# Altium schematic sheet MCU.SchDoc
size A4; SheetNumber: 2; SheetTotal: 2
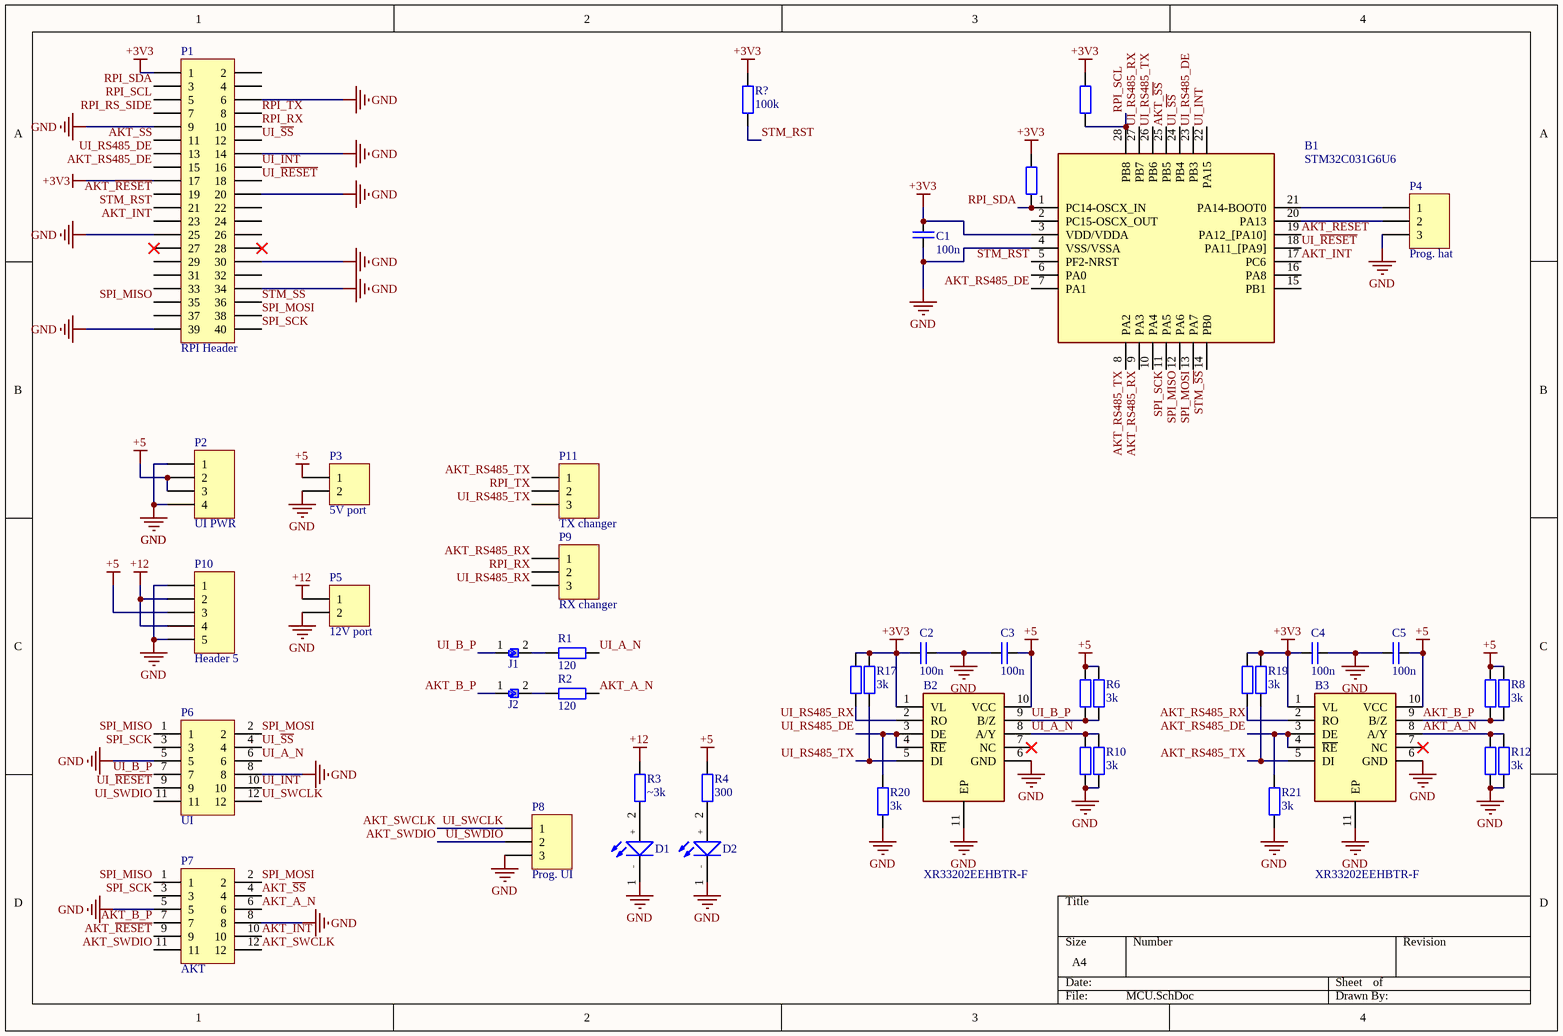
[diagram p0: MCU.SchDoc]

## Parts
B1  STM32C031G6U6  [QFN50P400X400X60-28N-D]
B2  XR33202EEHBTR-F  [SON50P300X300X80-11N-D]
B3  XR33202EEHBTR-F  [SON50P300X300X80-11N-D]
C1  100n  [R1005_0402i_L]
C2  100n  [R1005_0402i_L]
C3  100n  [R1005_0402i_L]
C4  100n  [R1005_0402i_L]
C5  100n  [R1005_0402i_L]
D1  LED  [LED1608_0603I_L]  (value not drawn)
D2  LED  [LED1608_0603I_L]  (value not drawn)
J1  solder_jumper  [solder_jumper_triangle]  (value not drawn)
J2  solder_jumper  [solder_jumper_triangle]  (value not drawn)
P1  RPI Header  [HDR2X20]
P2  UI PWR  [HDR1X4]
P3  5V port  [HDR1X2]
P4  Prog. hat  [HDR1X3]
P5  12V port  [HDR1X2]
P6  UI  [1.27mm headet tht]
P7  AKT  [1.27mm headet tht]
P8  Prog. UI  [HDR1X3]
P9  RX changer  [HDR1X3]
P10  Header 5  [HDR1X5]
P11  TX changer  [HDR1X3]
R1  120  [R1005_0402i_L]
R2  120  [R1005_0402i_L]
R3  ~3k  [R1005_0402i_L]
R4  300  [R1005_0402i_L]
R5  3k  [R1005_0402i_L]  (value not drawn)
R6  3k  [R1005_0402i_L]
R7  3k  [R1005_0402i_L]  (value not drawn)
R8  3k  [R1005_0402i_L]
R9  3k  [R1005_0402i_L]  (value not drawn)
R10  3k  [R1005_0402i_L]
R11  3k  [R1005_0402i_L]  (value not drawn)
R12  3k  [R1005_0402i_L]
R14  3k  [R1005_0402i_L]  (value not drawn)
R15  3k  [R1005_0402i_L]  (value not drawn)
R16  3k  [R1005_0402i_L]  (value not drawn)
R17  3k  [R1005_0402i_L]
R18  3k  [R1005_0402i_L]  (value not drawn)
R19  3k  [R1005_0402i_L]
R20  3k  [R1005_0402i_L]
R21  3k  [R1005_0402i_L]
R?  100k  [R1005_0402i_L]

## Nets
+3V3: B1.3(VDD/VDDA) B2.1(VL) B3.1(VL) C1.2 C2.1 C4.1 P1.1 P1.17 R14.2 R15.2 R16.2 R17.2 R18.2 R19.2 R?.2
+5: B2.10(VCC) B3.10(VCC) C3.2 C5.2 P2.2 P2.3 P3.1 P10.3 R4.1 R5.2 R6.2 R7.2 R8.2
+12: P5.1 P10.2 P10.4 R3.1
GND: B1.4(VSS/VSSA) B2.6(GND) B2.11(EP) B3.6(GND) B3.11(EP) C1.1 C2.2 C3.1 C4.2 C5.1 D1.1(-) D2.1(-) P1.6 P1.9 P1.14 P1.20 P1.25 P1.30 P1.34 P1.39 P2.1 P2.4 P3.2 P4.3 P5.2 P6.5 P6.8 P7.5 P7.8 P8.3 P10.1 P10.5 R9.1 R10.1 R11.1 R12.1 R20.1 R21.1
AKT_A_N: B3.8(A/Y) P7.6 R2.2 R11.2 R12.2
AKT_B_P: B3.9(B/Z) J2.1 P7.7 R7.1 R8.1
AKT_INT: B1.17(PC6) P1.23 P7.10
AKT_~{RESET}: B1.19(PA12_[PA10]) P1.19 P7.9
AKT_RS485_DE: B1.7(PA1) B3.3(DE) B3.4(~{RE}) P1.15 R21.2
AKT_RS485_RX: B1.9(PA3) B3.2(RO) P9.1 R18.1
AKT_RS485_TX: B1.8(PA2) B3.5(DI) P11.1 R19.1
AKT_~{SS}: B1.25(PB5) P1.11 P7.4
AKT_SWCLK: P6.12 P7.12 P8.1  [also labelled UI_SWCLK]
AKT_SWDIO: P6.11 P7.11 P8.2  [also labelled UI_SWDIO]
RPI_RS_SIDE: P1.7
RPI_RX: P1.10 P9.2
RPI_SCL: B1.28(PB8) P1.5 R14.1
RPI_SDA: B1.1(PC14-OSCX_IN) P1.3 R15.1
RPI_TX: P1.8 P11.2
SPI_MISO: B1.12(PA6) P1.35 P6.1 P7.1
SPI_MOSI: B1.13(PA7) P1.38 P6.2 P7.2
SPI_SCK: B1.11(PA5) P1.40 P6.3 P7.3
STM_RST: B1.5(PF2-NRST) P1.21 R?.1
STM_~{SS}: B1.14(PB0) P1.36
UI_A_N: B2.8(A/Y) P6.6 R1.2 R9.2 R10.2
UI_B_P: B2.9(B/Z) J1.1 P6.7 R5.1 R6.1
UI_INT: B1.22(PA15) P1.16 P6.10
UI_~{RESET}: B1.18(PA11_[PA9]) P1.18 P6.9
UI_RS485_DE: B1.23(PB3) B2.3(DE) B2.4(~{RE}) P1.13 R20.2
UI_RS485_RX: B1.27(PB7) B2.2(RO) P9.3 R16.1
UI_RS485_TX: B1.26(PB6) B2.5(DI) P11.3 R17.1
UI_~{SS}: B1.24(PB4) P1.12 P6.4
NetB1_20: B1.20(PA13) P4.2
NetB1_21: B1.21(PA14-BOOT0) P4.1
NetD1_2: D1.2(+) R3.2
NetD2_2: D2.2(+) R4.2
NetJ1_2: J1.2 R1.1
NetJ2_2: J2.2 R2.1

Not connected (* = marked no-connect by the designer): B1 2(PC15-OSCX_OUT) 6(PA0) 10(PA4) 15(PB1) 16(PA8); B2 7(NC)*; B3 7(NC)*; P1 2 4 22 24 26 27* 28* 29 31 32 33 37

## Library data of the parts
B1 = STM32C031G6U6: Mainstream Arm Cortex-M0+ MCU with 32 Kbytes of Flash memory, 12 Kbytes RAM, 48 MHz CPU, 2x USART, timers, ADC, comm. I/F, 2-3.6V; Manufacturer_Name: STMicroelectronics; Geometry.Height: 0.6mm; Mouser Part Number: 511-STM32C031G6U6; Mouser Price/Stock: https://www.mouser.co.uk/ProductDetail/STMicroelectronics/STM32C031G6U6?qs=IPgv5n7u5QZqRf3nOTChhw%3D%3D; Manufacturer_Part_Number: STM32C031G6U6; Datasheet Link: https://www.st.com/resource/en/datasheet/stm32c031c4.pdf
B2 B3 = XR33202EEHBTR-F: RS-422/RS-485 Interface IC Wide Supply Trans with I/O Interface; Manufacturer_Name: MaxLinear, Inc.; Geometry.Height: 0.8mm; Mouser Part Number: 701-XR33202EEHBTR-F; Mouser Price/Stock: https://www.mouser.co.uk/ProductDetail/MaxLinear/XR33202EEHBTR-F?qs=GtWAI9k6EVi4nRW8bj1LFw%3D%3D; Manufacturer_Part_Number: XR33202EEHBTR-F; Datasheet Link: https://www.maxlinear.com/ds/xr33202.pdf
C1-C5 = C: Capacitor
P1 = Header 20X2: Header, 20-Pin, Dual row; LatestRevisionDate: 17-Jul-2002; LatestRevisionNote: Re-released for DXP Platform.; Publisher: Altium Limited
P2 = Header 4: Header, 4-Pin; LatestRevisionDate: 17-Jul-2002; LatestRevisionNote: Re-released for DXP Platform.; Publisher: Altium Limited
P3 P5 = Header 2: Header, 2-Pin; LatestRevisionDate: 17-Jul-2002; LatestRevisionNote: Re-released for DXP Platform.; Publisher: Altium Limited
P4 P8 P9 P11 = Header 3: Header, 3-Pin; LatestRevisionDate: 17-Jul-2002; LatestRevisionNote: Re-released for DXP Platform.; Publisher: Altium Limited
P6 P7 = 2x6 THT Header
P10 = Header 5: Header, 5-Pin; LatestRevisionDate: 17-Jul-2002; LatestRevisionNote: Re-released for DXP Platform.; Publisher: Altium Limited
R1-R12 R14-R21 R? = R